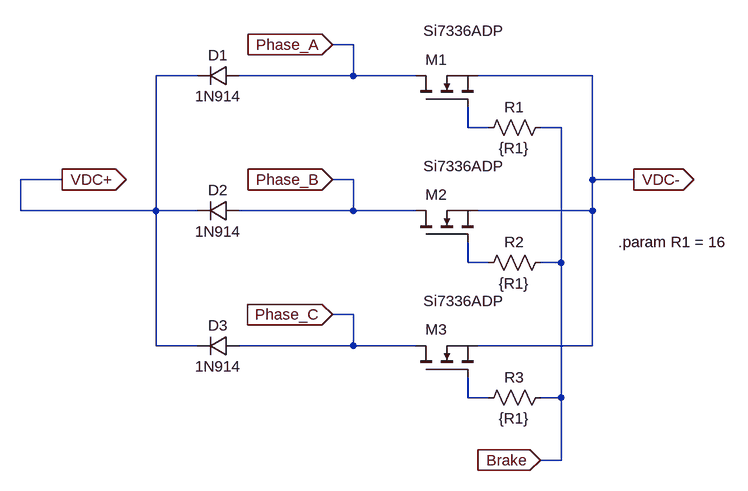
[diagram p0: schematic brakerectifier.asc]
brakerectifier.asc, the LTspice schematic file:
Version 4
SHEET 1 1372 680
WIRE 240 -48 208 -48
WIRE 0 0 -64 0
WIRE 240 0 240 -48
WIRE 240 0 64 0
WIRE 336 0 240 0
WIRE 608 0 432 0
WIRE 416 80 416 48
WIRE 448 80 416 80
WIRE 560 80 528 80
WIRE -208 160 -272 160
WIRE 240 160 208 160
WIRE 608 160 608 0
WIRE 672 160 608 160
WIRE -272 208 -272 160
WIRE -64 208 -64 0
WIRE -64 208 -272 208
WIRE 0 208 -64 208
WIRE 240 208 240 160
WIRE 240 208 64 208
WIRE 336 208 240 208
WIRE 608 208 608 160
WIRE 608 208 432 208
WIRE 416 288 416 256
WIRE 448 288 416 288
WIRE 560 288 560 80
WIRE 560 288 528 288
WIRE 240 368 208 368
WIRE -64 416 -64 208
WIRE 0 416 -64 416
WIRE 240 416 240 368
WIRE 240 416 64 416
WIRE 336 416 240 416
WIRE 608 416 608 208
WIRE 608 416 432 416
WIRE 416 496 416 464
WIRE 448 496 416 496
WIRE 560 496 560 288
WIRE 560 496 528 496
WIRE 560 592 560 496
WIRE 560 592 528 592
FLAG 208 -48 Phase_A
IOPIN 208 -48 In
FLAG 208 160 Phase_B
IOPIN 208 160 In
FLAG 208 368 Phase_C
IOPIN 208 368 In
FLAG -208 160 VDC+
IOPIN -208 160 Out
FLAG 672 160 VDC-
IOPIN 672 160 Out
FLAG 528 592 Brake
IOPIN 528 592 In
SYMBOL diode 64 -16 R90
WINDOW 0 0 32 VBottom 2
WINDOW 3 32 32 VTop 2
SYMATTR InstName D1
SYMATTR Value 1N914
SYMBOL diode 64 192 R90
WINDOW 0 0 32 VBottom 2
WINDOW 3 32 32 VTop 2
SYMATTR InstName D2
SYMATTR Value 1N914
SYMBOL diode 64 400 R90
WINDOW 0 0 32 VBottom 2
WINDOW 3 32 32 VTop 2
SYMATTR InstName D3
SYMATTR Value 1N914
SYMBOL nmos 336 48 R270
WINDOW 0 73 15 VRight 2
WINDOW 3 117 12 VRight 2
SYMATTR InstName M1
SYMATTR Value Si7336ADP
SYMBOL nmos 336 256 R270
WINDOW 0 73 15 VRight 2
WINDOW 3 117 12 VRight 2
SYMATTR InstName M2
SYMATTR Value Si7336ADP
SYMBOL nmos 336 464 R270
WINDOW 0 73 15 VRight 2
WINDOW 3 117 12 VRight 2
SYMATTR InstName M3
SYMATTR Value Si7336ADP
SYMBOL res 544 64 R90
WINDOW 0 0 56 VBottom 2
WINDOW 3 32 56 VTop 2
SYMATTR InstName R1
SYMATTR Value {R1}
SYMBOL res 544 272 R90
WINDOW 0 0 56 VBottom 2
WINDOW 3 32 56 VTop 2
SYMATTR InstName R2
SYMATTR Value {R1}
SYMBOL res 544 480 R90
WINDOW 0 0 56 VBottom 2
WINDOW 3 32 56 VTop 2
SYMATTR InstName R3
SYMATTR Value {R1}
TEXT 648 256 Left 2 !.param R1 = 16

The netlist it stands for:
* brakerectifier.asc
D1 Phase_A VDC+ 1N914
D2 Phase_B VDC+ 1N914
D3 Phase_C VDC+ 1N914
M1 Phase_A N001 VDC- VDC- Si7336ADP
M2 Phase_B N002 VDC- VDC- Si7336ADP
M3 Phase_C N003 VDC- VDC- Si7336ADP
R1 Brake N001 {R1}
R2 Brake N002 {R1}
R3 Brake N003 {R1}
.model D D
.lib standard.dio
.model NMOS NMOS
.model PMOS PMOS
.lib standard.mos
.param R1 = 16
.backanno
.end